# Altium project BUCK-BOOST_PWM_Controller.PrjPcb
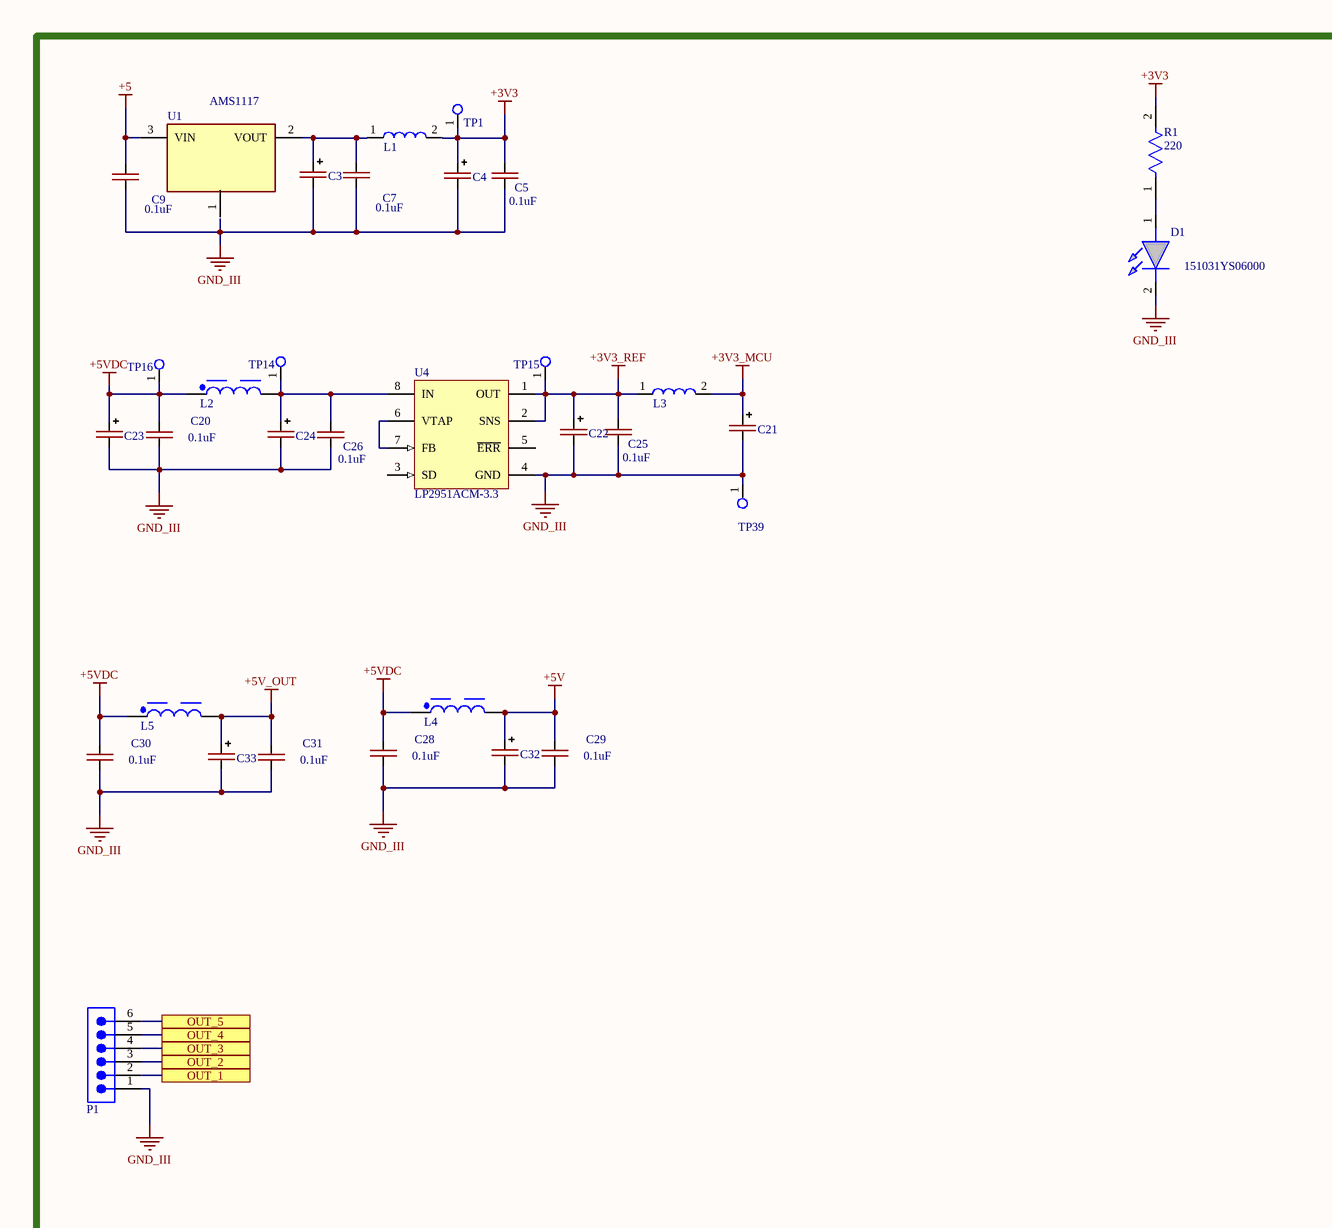
[diagram p0: BUCK-BOOST_PWM_Controller.SchDoc, top left]
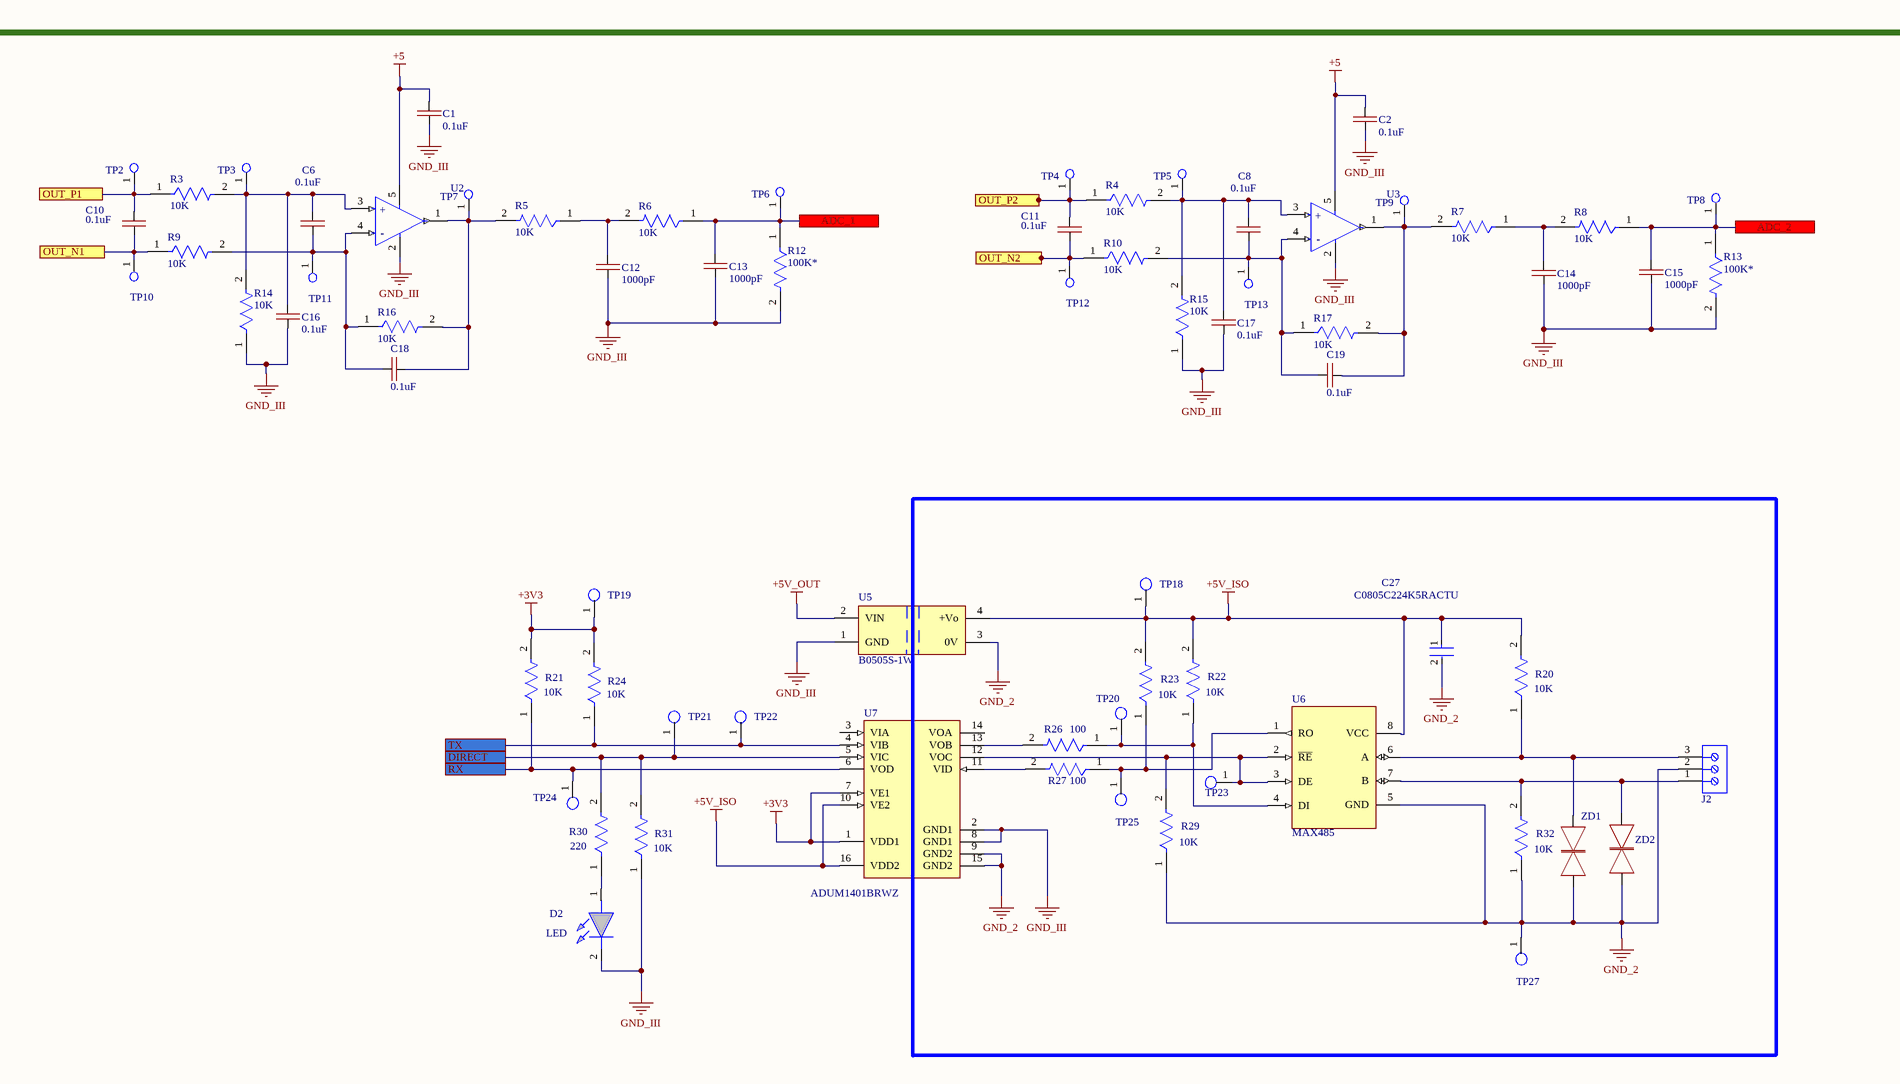
[diagram p1: BUCK-BOOST_PWM_Controller.SchDoc, top middle]
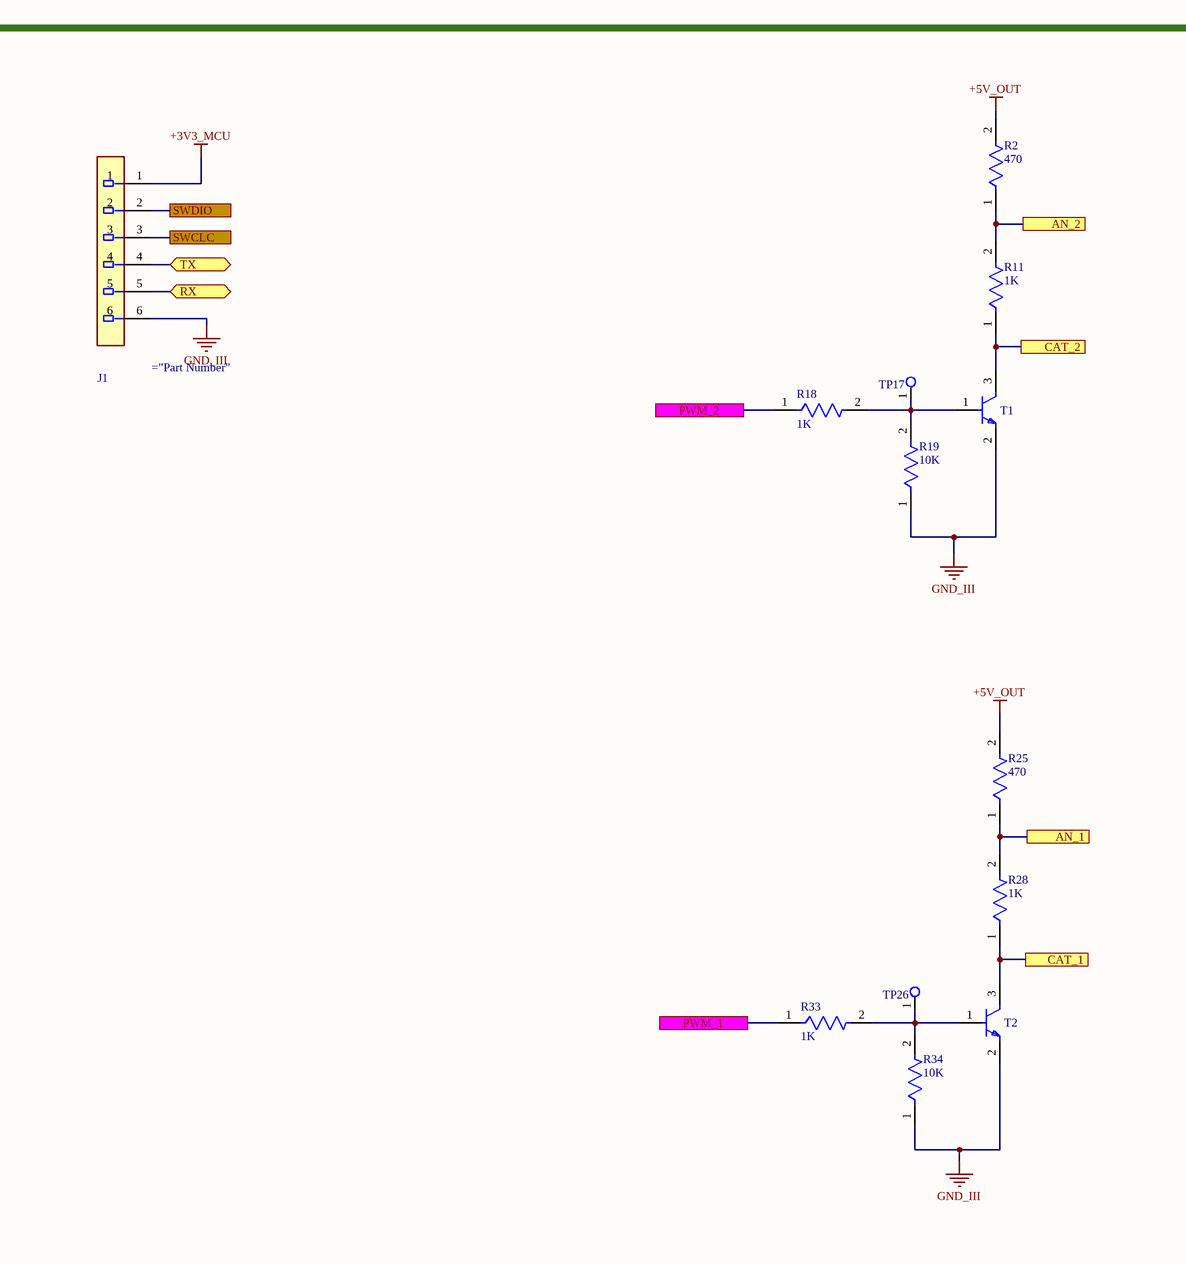
[diagram p2: BUCK-BOOST_PWM_Controller.SchDoc, top right]
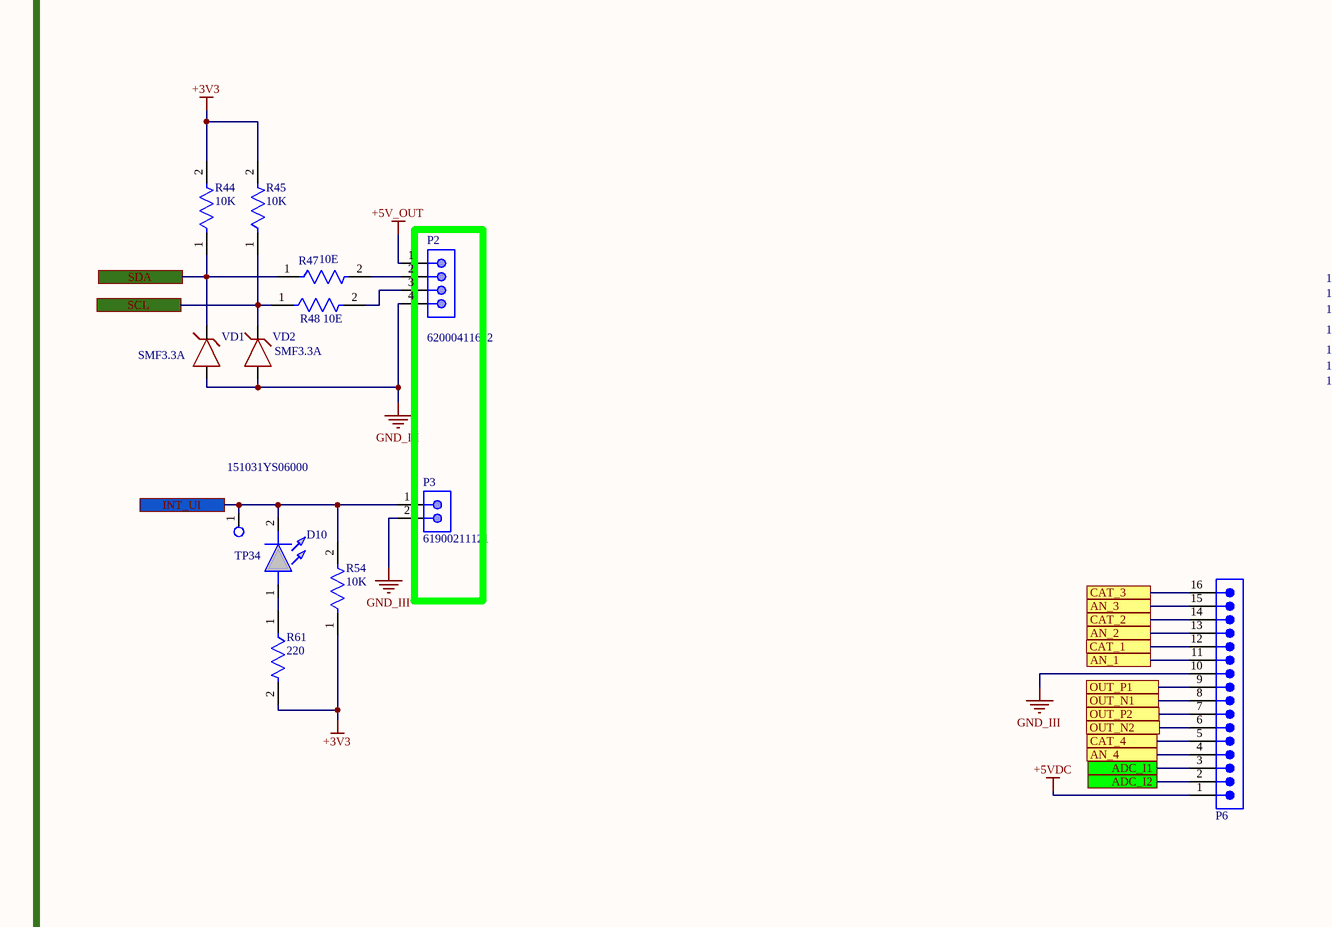
[diagram p3: BUCK-BOOST_PWM_Controller.SchDoc, bottom left]
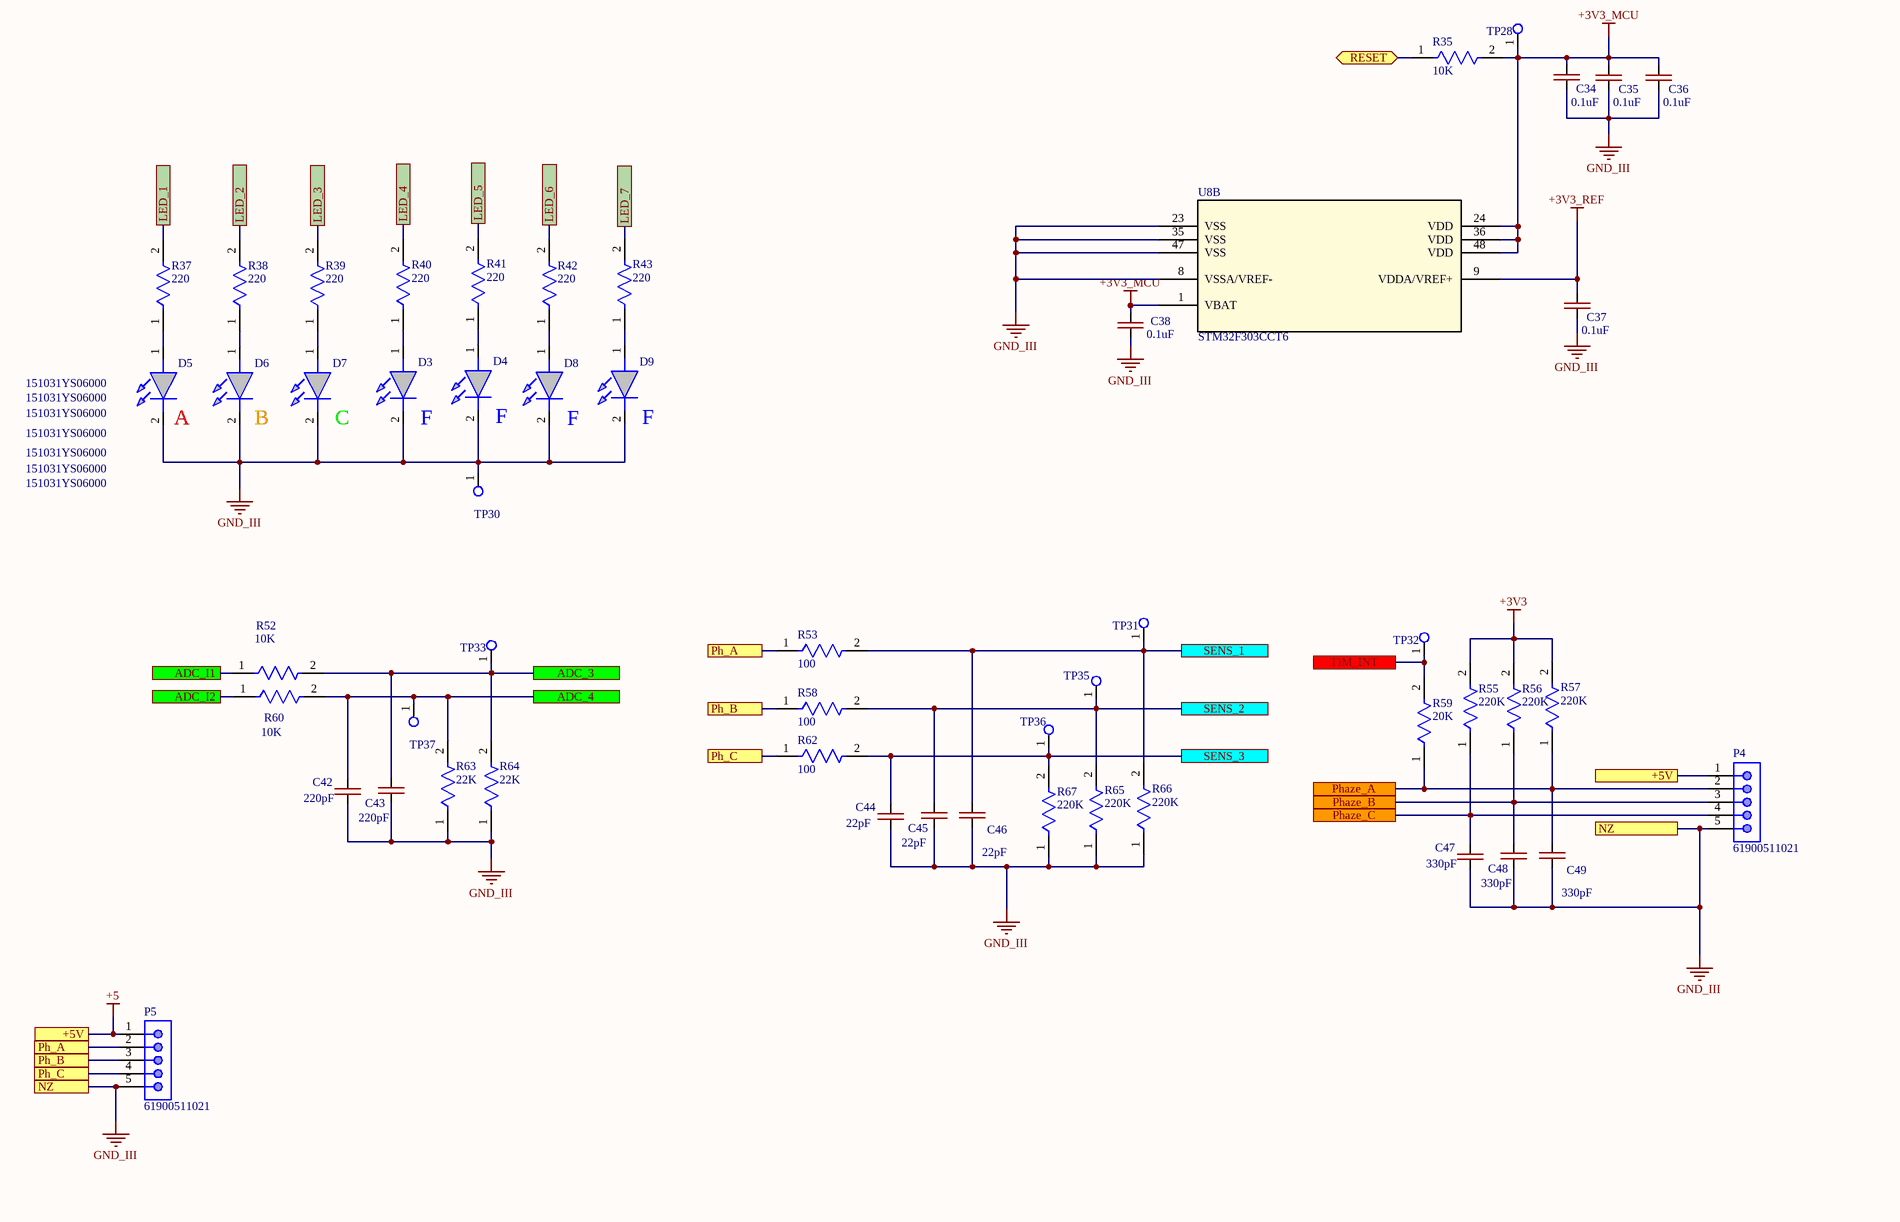
[diagram p4: BUCK-BOOST_PWM_Controller.SchDoc, bottom middle]
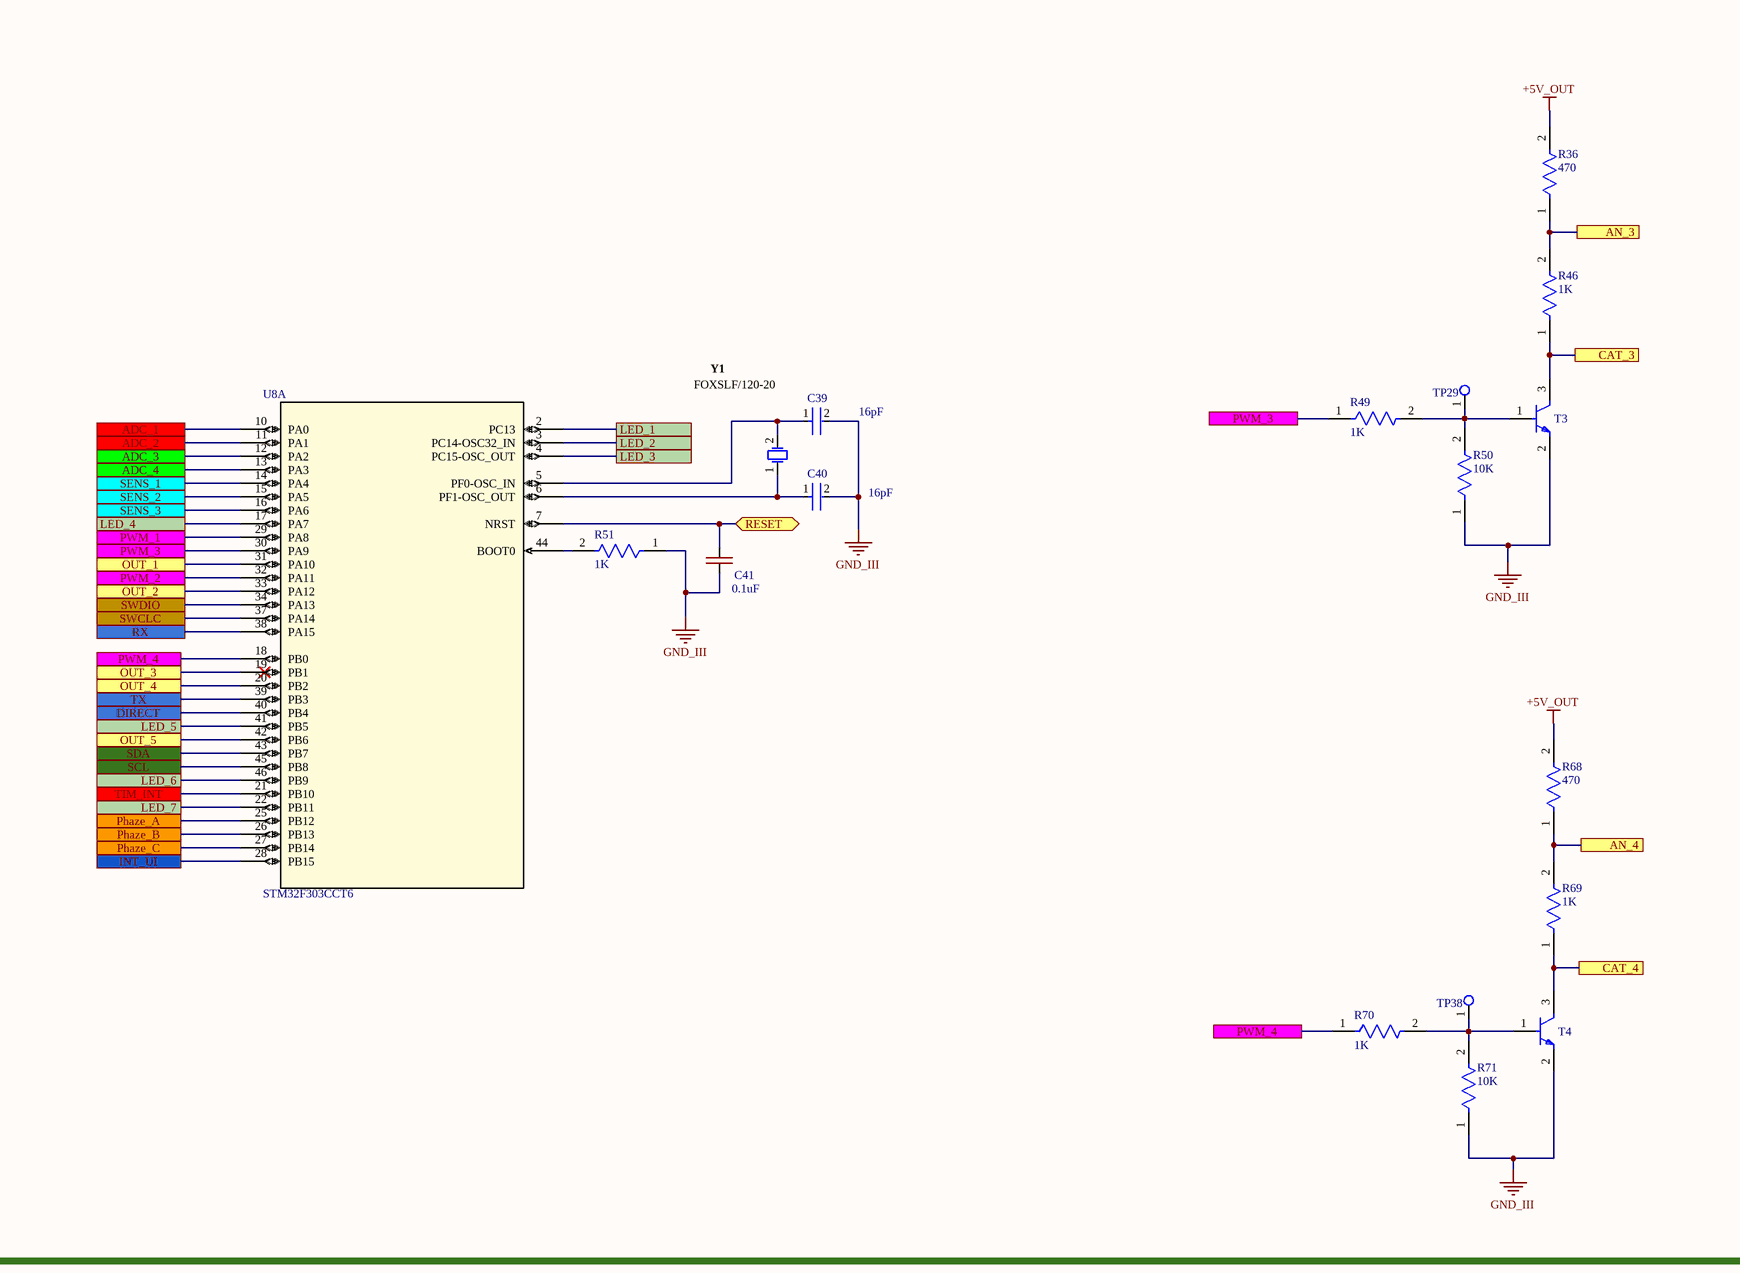
[diagram p5: BUCK-BOOST_PWM_Controller.SchDoc, bottom right]
1 sheet, 199 parts. Net scope: flat (ports and power ports of the same name join across sheets).
Board file: BUCK-BOOST_PWM_Controller.PcbDoc

## Sheet BUCK-BOOST_PWM_Controller.SchDoc
size A0; SheetNumber: 1; SheetTotal: 1; SPICEModelCacheFPQAHQWD: <root> / <DocumentId>FPQAHQWD</DocumentId> / <CacheFrame Number="0"> / <Model Name="7850_74477530_1m" Kind="CKT"> / <Text>******* / .subckt 7850_74477530_1m 1 2 / Rp 1 2 187304.915771 / Cp 1 2 4.36976277949p / Rs 1 N3 3.3 / L1 N3 2 1000u / .ends 7850_74477530_1m</Text> / </Model> / </CacheFrame> / </root>

### Parts
C1  0.1uF  [CAP-0805]
C2  0.1uF  [CAP-0805]
C3  CAP-POLAR  [CAP_SMD_Size_E]  (value not drawn)
C4  CAP-POLAR  [CAP_SMD_Size_E]  (value not drawn)
C5  0.1uF  [CAP-0805]
C6  0.1uF  [CAP-0805]
C7  0.1uF  [CAP-0805]
C8  0.1uF  [CAP-0805]
C9  0.1uF  [CAP-0805]
C10  0.1uF  [CAP-0805]
C11  0.1uF  [CAP-0805]
C12  1000pF  [CAP-0805]
C13  1000pF  [CAP-0805]
C14  1000pF  [CAP-0805]
C15  1000pF  [CAP-0805]
C16  0.1uF  [CAP-0805]
C17  0.1uF  [CAP-0805]
C18  0.1uF  [CAP-0805]
C19  0.1uF  [CAP-0805]
C20  0.1uF  [CAP-0805]
C21  CAP-POLAR  [CAP_SMD_Size_E]  (value not drawn)
C22  CAP-POLAR  [CAP-TAN-D]  (value not drawn)
C23  CAP-POLAR  [CAP_SMD_Size_E]  (value not drawn)
C24  CAP-POLAR  [CAP_SMD_Size_E]  (value not drawn)
C25  0.1uF  [CAP-0805]
C26  0.1uF  [CAP-0805]
C27  C0805C224K5RACTU  [FP-C0805C-DN-MFG]
C28  0.1uF  [CAP-0805]
C29  0.1uF  [CAP-0805]
C30  0.1uF  [CAP-0805]
C31  0.1uF  [CAP-0805]
C32  CAP-POLAR  [CAP_SMD_Size_E]  (value not drawn)
C33  CAP-POLAR  [CAP_SMD_Size_E]  (value not drawn)
C34  0.1uF  [CAP-0805]
C35  0.1uF  [CAP-0805]
C36  0.1uF  [CAP-0805]
C37  0.1uF  [CAP-0805]
C38  0.1uF  [CAP-0805]
C39  16pF  [FP-GRM21B-0_1-IPC_C]
C40  16pF  [FP-GRM21B-0_1-IPC_C]
C41  0.1uF  [CAP-0805]
C42  220pF  [CAP-0805]
C43  220pF  [CAP-0805]
C44  22pF  [CAP-0805]
C45  22pF  [CAP-0805]
C46  22pF  [CAP-0805]
C47  330pF  [CAP-0805]
C48  330pF  [CAP-0805]
C49  330pF  [CAP-0805]
D1  151031YS06000  [LED_GREEN]
D2  LED  [LED_BLUE]
D3  151031YS06000  [LED_BLUE]
D4  151031YS06000  [LED_BLUE]
D5  151031YS06000  [LED_RED]
D6  151031YS06000  [LED_YELLOW]
D7  151031YS06000  [LED_GREEN]
D8  151031YS06000  [LED_BLUE]
D9  151031YS06000  [LED_BLUE]
D10  151031YS06000  [LED_RED]
J1  SWR25X-NRTC-S06-ST-BA  [Sullins_SWR25X-NRTC-S06-ST-BA_MFG]  (value not drawn)
J2  (no value)  [691101710003]
L1  Coil  [NR4030]  (value not drawn)
L2  1000µH, 0.3A  [WE-PD2_7850]  (value not drawn)
L3  Coil  [NR4030]  (value not drawn)
L4  1000µH, 0.3A  [WE-PD2_7850]  (value not drawn)
L5  1000µH, 0.3A  [WE-PD2_7850]  (value not drawn)
P1  61300611121  [61300611121]  (value not drawn)
P2  62000411622  [62000411622]
P3  61900211121  [61900211121]
P4  61900511021  [61900511021]
P5  61900511021  [61900511021]
P6  61301611021  [61301611021]  (value not drawn)
R1  220  [RES-0805]
R2  470  [RES-0805]
R3  10K  [RES-0805]
R4  10K  [RES-0805]
R5  10K  [RES-0805]
R6  10K  [RES-0805]
R7  10K  [RES-0805]
R8  10K  [RES-0805]
R9  10K  [RES-0805]
R10  10K  [RES-0805]
R11  1K  [RES-0805]
R12  100K*  [RES-0805]
R13  100K*  [RES-0805]
R14  10K  [RES-0805]
R15  10K  [RES-0805]
R16  10K  [RES-0805]
R17  10K  [RES-0805]
R18  1K  [RES-0805]
R19  10K  [RES-0805]
R20  10K  [RES-0805]
R21  10K  [RES-0805]
R22  10K  [RES-0805]
R23  10K  [RES-0805]
R24  10K  [RES-0805]
R25  470  [RES-0805]
R26  100  [RES-0805]
R27  100  [RES-0805]
R28  1K  [RES-0805]
R29  10K  [RES-0805]
R30  220  [RES-0805]
R31  10K  [RES-0805]
R32  10K  [RES-0805]
R33  1K  [RES-0805]
R34  10K  [RES-0805]
R35  10K  [RES-0805]
R36  470  [RES-0805]
R37  220  [RES-0805]
R38  220  [RES-0805]
R39  220  [RES-0805]
R40  220  [RES-0805]
R41  220  [RES-0805]
R42  220  [RES-0805]
R43  220  [RES-0805]
R44  10K  [RES-0805]
R45  10K  [RES-0805]
R46  1K  [RES-0805]
R47  10E  [RES-0805]
R48  10E  [RES-0805]
R49  1K  [RES-0805]
R50  10K  [RES-0805]
R51  1K  [RES-0805]
R52  10K  [RES-0805]
R53  100  [RES-0805]
R54  10K  [RES-0805]
R55  220K  [RES-0805]
R56  220K  [RES-0805]
R57  220K  [RES-0805]
R58  100  [RES-0805]
R59  20K  [RES-0805]
R60  10K  [RES-0805]
R61  220  [RES-0805]
R62  100  [RES-0805]
R63  22K  [RES-0805]
R64  22K  [RES-0805]
R65  220K  [RES-0805]
R66  220K  [RES-0805]
R67  220K  [RES-0805]
R68  470  [RES-0805]
R69  1K  [RES-0805]
R70  1K  [RES-0805]
R71  10K  [RES-0805]
T1  BC847C  [SOT23-3_IPC_A]  (value not drawn)
T2  BC847C  [SOT23-3_IPC_A]  (value not drawn)
T3  BC847C  [SOT23-3_IPC_A]  (value not drawn)
T4  BC847C  [SOT23-3_IPC_A]  (value not drawn)
TP1  Test_Point_PCB  [Test_Point]  (value not drawn)
TP2  Test_Point_PCB  [Test_Point]  (value not drawn)
TP3  Test_Point_PCB  [Test_Point]  (value not drawn)
TP4  Test_Point_PCB  [Test_Point]  (value not drawn)
TP5  Test_Point_PCB  [Test_Point]  (value not drawn)
TP6  Test_Point_PCB  [Test_Point]  (value not drawn)
TP7  Test_Point_PCB  [Test_Point]  (value not drawn)
TP8  Test_Point_PCB  [Test_Point]  (value not drawn)
TP9  Test_Point_PCB  [Test_Point]  (value not drawn)
TP10  Test_Point_PCB  [Test_Point]  (value not drawn)
TP11  Test_Point_PCB  [Test_Point]  (value not drawn)
TP12  Test_Point_PCB  [Test_Point]  (value not drawn)
TP13  Test_Point_PCB  [Test_Point]  (value not drawn)
TP14  Test_Point_PCB  [Test_Point]  (value not drawn)
TP15  Test_Point_PCB  [Test_Point]  (value not drawn)
TP16  Test_Point_PCB  [Test_Point]  (value not drawn)
TP17  Test_Point_PCB  [Test_Point]  (value not drawn)
TP18  Test_Point_PCB  [Test_Point]  (value not drawn)
TP19  (no value)  [Test_Point]
TP20  Test_Point_PCB  [Test_Point]  (value not drawn)
TP21  Test_Point_PCB  [Test_Point]  (value not drawn)
TP22  Test_Point_PCB  [Test_Point]  (value not drawn)
TP23  Test_Point_PCB  [Test_Point]  (value not drawn)
TP24  Test_Point_PCB  [Test_Point]  (value not drawn)
TP25  (no value)  [Test_Point]
TP26  Test_Point_PCB  [Test_Point]  (value not drawn)
TP27  Test_Point_PCB  [Test_Point]  (value not drawn)
TP28  Test_Point_PCB  [Test_Point]  (value not drawn)
TP29  Test_Point_PCB  [Test_Point]  (value not drawn)
TP30  Test_Point_PCB  [Pin_Test_Point(Pink)]  (value not drawn)
TP31  Test_Point_PCB  [Test_Point]  (value not drawn)
TP32  Test_Point_PCB  [Test_Point]  (value not drawn)
TP33  Test_Point_PCB  [Test_Point]  (value not drawn)
TP34  Test_Point_PCB  [Test_Point]  (value not drawn)
TP35  Test_Point_PCB  [Test_Point]  (value not drawn)
TP36  Test_Point_PCB  [Test_Point]  (value not drawn)
TP37  Test_Point_PCB  [Test_Point]  (value not drawn)
TP38  Test_Point_PCB  [Test_Point]  (value not drawn)
TP39  Test_Point_PCB  [Pin_Test_Point(Orange)]  (value not drawn)
U1  AMS1117  [SOT-89]
U2  (no value)  [SOT-23-5]
U3  (no value)  [SOT-23-5]
U4  LP2951ACM-3.3  [D0008A_N]
U5  B0505S-1W  [B0505S-1W]
U6  MAX485  [SOIC-8-MFG]
U7  ADUM1401BRWZ  [ADI-RW-16_M]
U8  STM32F303CCT6  [LQFP48-7x7mm]  (parts A,B of 2)
VD1  SMF3.3A  [SMF3.3A]
VD2  SMF3.3A  [SMF3.3A]
Y1  FOXSLF/120-20  [FOX-FOXSLF-2_V]
ZD1  P6SMB16CA  [DO-214AA]  (value not drawn)
ZD2  P6SMB16CA  [DO-214AA]  (value not drawn)

### Ports
+5V, ADC_1, ADC_2, ADC_3, ADC_4, ADC_I1, ADC_I2, AN_1, AN_2, AN_3, AN_4, CAT_1, CAT_2, CAT_3, CAT_4, DIRECT, INT_UI, LED_1, LED_2, LED_3, LED_4, LED_5, LED_6, LED_7, NZ, OUT_1, OUT_2, OUT_3, OUT_4, OUT_5, OUT_N1, OUT_N2, OUT_P1, OUT_P2, Ph_A, Ph_B, Ph_C, Phaze_A, Phaze_B, Phaze_C, PWM_1, PWM_2, PWM_3, PWM_4, RESET (bidir), RX, RX (bidir), SCL, SDA, SENS_1, SENS_2, SENS_3, SWCLC, SWDIO, TIM_INT, TX, TX (bidir)

### Nets
+3V3: C4.1(+) C5.2 L1.2 R1.2 R21.2 R24.2 R44.2 R45.2 R54.1 R55.2 R56.2 R57.2 R61.2 TP1.1(G9) TP19.1(G9) U7.1(VDD1) U7.7(VE1)
+3V3_MCU: C21.1(+) C34.2 C35.2 C36.2 C38.2 J1.1 L3.2 R35.2 TP28.1(G9) U8.1(VBAT) U8.24(VDD) U8.36(VDD) U8.48(VDD)
+3V3_REF: C22.1(+) C25.2 C37.2 L3.1 TP15.1(G9) U4.1(OUT) U4.2(SNS) U8.9(VDDA/VREF+)
+5: C1.2 C2.2 C9.2 P4.1 P5.1 U1.3(VIN) U2.5(VDD) U3.5(VDD) ; port +5V
+5V: C29.2 C32.1(+) L4.2
+5V_ISO: C27.1 R20.2 R22.2 R23.2 TP18.1(G9) U5.4(+Vo) U6.8(VCC) U7.10(VE2) U7.16(VDD2)
+5V_OUT: C31.2 C33.1(+) L5.2 P2.1 R2.2 R25.2 R36.2 R68.2 U5.2(VIN)
+5VDC: C20.2 C23.1(+) C28.2 C30.2 L2.1 L4.1 L5.1 P6.1 TP16.1(G9)
GND_2: C27.2 J2.2 R29.1 R32.1 TP27.1(G9) U5.3(0V) U6.5(GND) U7.9(GND2) U7.15(GND2) ZD1.1(A) ZD2.1(A)
GND_III: C1.1 C2.1 C3.2(-) C4.2(-) C5.1 C7.1 C9.1 C12.1 C13.1 C14.1 C15.1 C16.1 C17.1 C20.1 C21.2(-) C22.2(-) C23.2(-) C24.2(-) C25.1 C26.1 C28.1 C29.1 C30.1 C31.1 C32.2(-) C33.2(-) C34.1 C35.1 C36.1 C37.1 C38.1 C39.2 C40.2 C41.1 C42.1 C43.1 C44.1 C45.1 C46.1 C47.1 C48.1 C49.1 D1.2(K) D2.2(K) D3.2(K) D4.2(K) D5.2(K) D6.2(K) D7.2(K) D8.2(K) D9.2(K) J1.6 P1.1 P2.4 P3.2 P4.5 P5.5 P6.10 R12.2 R13.2 R14.1 R15.1 R19.1 R31.1 R34.1 R50.1 R51.1 R63.1 R64.1 R65.1 R66.1 R67.1 R71.1 T1.2(E) T2.2(E) T3.2(E) T4.2(E) TP30.1(G9) TP39.1(G9) U2.2(VSS) U3.2(VSS) U4.4(GND) U5.1(GND) U7.2(GND1) U7.8(GND1) U8.8(VSSA/VREF-) U8.23(VSS) U8.35(VSS) U8.47(VSS) VD1.1(A) VD2.1(A) ; port NZ
NetC3_1: C3.1(+) C7.2 L1.1 U1.2(VOUT)
NetC6_1: C6.1 C18.1 R9.2 R16.1 TP11.1(G9) U2.4(VIN-)
NetC6_2: C6.2 C16.2 R3.2 R14.2 TP3.1(G9) U2.3(VIN+)
NetC8_1: C8.1 C19.1 R10.2 R17.1 TP13.1(G9) U3.4(VIN-)
NetC8_2: C8.2 C17.2 R4.2 R15.2 TP5.1(G9) U3.3(VIN+)
NetC10_1: C10.1 P6.8 R9.1 TP10.1(G9) ; port OUT_N1
NetC10_2: C10.2 P6.9 R3.1 TP2.1(G9) ; port OUT_P1
NetC11_1: C11.1 P6.6 R10.1 TP12.1(G9) ; port OUT_N2
NetC11_2: C11.2 P6.7 R4.1 TP4.1(G9) ; port OUT_P2
NetC12_2: C12.2 R5.1 R6.2
NetC13_2: C13.2 R6.1 R12.1 TP6.1(G9) U8.10(PA0) ; port ADC_1
NetC14_2: C14.2 R7.1 R8.2
NetC15_2: C15.2 R8.1 R13.1 TP8.1(G9) U8.11(PA1) ; port ADC_2
NetC18_2: C18.2 R5.2 R16.2 TP7.1(G9) U2.1(VOUT)
NetC19_2: C19.2 R7.2 R17.2 TP9.1(G9) U3.1(VOUT)
NetC24_1: C24.1(+) C26.2 L2.2 TP14.1(G9) U4.8(IN)
NetC39_1: C39.1 U8.5(PF0-OSC_IN) Y1.2
NetC40_1: C40.1 U8.6(PF1-OSC_OUT) Y1.1
NetC41_2: C41.2 R35.1 U8.7(NRST) ; port RESET
NetC42_2: C42.2 R60.2 R63.2 TP37.1(G9) U8.13(PA3) ; port ADC_4
NetC43_2: C43.2 R52.2 R64.2 TP33.1(G9) U8.12(PA2) ; port ADC_3
NetC44_2: C44.2 R62.2 R67.2 TP36.1(G9) U8.16(PA6) ; port SENS_3
NetC45_2: C45.2 R58.2 R65.2 TP35.1(G9) U8.15(PA5) ; port SENS_2
NetC46_2: C46.2 R53.2 R66.2 TP31.1(G9) U8.14(PA4) ; port SENS_1
NetC47_2: C47.2 P4.4 R55.1 U8.27(PB14) ; port Phaze_C
NetC48_2: C48.2 P4.3 R56.1 U8.26(PB13) ; port Phaze_B
NetC49_2: C49.2 P4.2 R57.1 R59.1 U8.25(PB12) ; port Phaze_A
NetD1_1: D1.1(A) R1.1
NetD2_1: D2.1(A) R30.1
NetD3_1: D3.1(A) R40.1
NetD4_1: D4.1(A) R41.1
NetD5_1: D5.1(A) R37.1
NetD6_1: D6.1(A) R38.1
NetD7_1: D7.1(A) R39.1
NetD8_1: D8.1(A) R42.1
NetD9_1: D9.1(A) R43.1
NetD10_1: D10.1(A) R61.1
NetD10_2: D10.2(K) P3.1 R54.2 TP34.1(G9) U8.28(PB15) ; port INT_UI
NetJ1_2: J1.2 U8.34(PA13) ; port SWDIO
NetJ1_3: J1.3 U8.37(PA14) ; port SWCLC
NetJ1_4: J1.4 R24.1 TP22.1(G9) U7.4(VIB) U8.39(PB3) ; port TX
NetJ1_5: J1.5 R21.1 TP24.1(G9) U7.6(VOD) U8.38(PA15) ; port RX
NetJ2_1: J2.1 R32.2 U6.7(B) ZD2.2(A)
NetJ2_3: J2.3 R20.1 U6.6(A) ZD1.2(A)
NetP1_2: P1.2 U8.31(PA10) ; port OUT_1
NetP1_3: P1.3 U8.33(PA12) ; port OUT_2
NetP1_4: P1.4 U8.19(PB1) ; port OUT_3
NetP1_5: P1.5 U8.20(PB2) ; port OUT_4
NetP1_6: P1.6 U8.42(PB6) ; port OUT_5
NetP2_2: P2.2 R47.2
NetP2_3: P2.3 R48.2
NetP5_2: P5.2 R53.1 ; port Ph_A
NetP5_3: P5.3 R58.1 ; port Ph_B
NetP5_4: P5.4 R62.1 ; port Ph_C
NetP6_2: P6.2 R60.1 ; port ADC_I2
NetP6_3: P6.3 R52.1 ; port ADC_I1
NetP6_4: P6.4 R68.1 R69.2 ; port AN_4
NetP6_5: P6.5 R69.1 T4.3(C) ; port CAT_4
NetP6_11: P6.11 R25.1 R28.2 ; port AN_1
NetP6_12: P6.12 R28.1 T2.3(C) ; port CAT_1
NetP6_13: P6.13 R2.1 R11.2 ; port AN_2
NetP6_14: P6.14 R11.1 T1.3(C) ; port CAT_2
NetP6_15: P6.15 R36.1 R46.2 ; port AN_3
NetP6_16: P6.16 R46.1 T3.3(C) ; port CAT_3
NetR18_1: R18.1 U8.32(PA11) ; port PWM_2
NetR18_2: R18.2 R19.2 T1.1(B) TP17.1(G9)
NetR22_1: R22.1 R26.1 TP20.1(G9) U6.4(DI)
NetR23_1: R23.1 R27.1 TP25.1(G9) U6.1(RO)
NetR26_2: R26.2 U7.13(VOB)
NetR27_2: R27.2 U7.11(VID)
NetR29_2: R29.2 TP23.1(G9) U6.2(~{RE}) U6.3(DE) U7.12(VOC)
NetR30_2: R30.2 R31.2 TP21.1(G9) U7.5(VIC) U8.40(PB4) ; port DIRECT
NetR33_1: R33.1 U8.29(PA8) ; port PWM_1
NetR33_2: R33.2 R34.2 T2.1(B) TP26.1(G9)
NetR37_2: R37.2 U8.2(PC13) ; port LED_1
NetR38_2: R38.2 U8.3(PC14-OSC32_IN) ; port LED_2
NetR39_2: R39.2 U8.4(PC15-OSC_OUT) ; port LED_3
NetR40_2: R40.2 U8.17(PA7) ; port LED_4
NetR41_2: R41.2 U8.41(PB5) ; port LED_5
NetR42_2: R42.2 U8.46(PB9) ; port LED_6
NetR43_2: R43.2 U8.22(PB11) ; port LED_7
NetR44_1: R44.1 R47.1 U8.43(PB7) VD1.2(C) ; port SDA
NetR45_1: R45.1 R48.1 U8.45(PB8) VD2.2(C) ; port SCL
NetR49_1: R49.1 U8.30(PA9) ; port PWM_3
NetR49_2: R49.2 R50.2 T3.1(B) TP29.1(G9)
NetR51_2: R51.2 U8.44(BOOT0)
NetR59_2: R59.2 TP32.1(G9) U8.21(PB10) ; port TIM_INT
NetR70_1: R70.1 U8.18(PB0) ; port PWM_4
NetR70_2: R70.2 R71.2 T4.1(B) TP38.1(G9)
NetU4_6: U4.6(VTAP) U4.7(FB)

Not connected (* = marked no-connect by the designer): U1 1(Ground); U4 3(SD) 5(~{ERR}); U7 3(VIA) 14(VOA)

### Notes on the sheet
- (near D5) A
- (near D6) B
- (near D7) C
- (near D3) F
- (near D4) F
- (near D8) F
- (near D9) F
- (in symbol MCP6001T) +; -

### Library data of the parts
C1 C2 C5-C20 C25 C26 C28-C31 C34-C38 C41-C49 = CAP-NON-POLAR
C27 = CMP-1036-04552-2: CAP CER 0.22UF 50V X7R 0805; Manufacturer: KEMET; Value: 0.22 μF; Temperature Coefficient: 30ppm/°C; Material: Ceramic; Tolerance: 0.1; ComponentLink2URL: https://content.kemet.com/datasheets/KEM_C1003_C0G_SMD.pdf; Temperature Characteristic: X7R; Device Class L3: Ceramic Capacitors; Lead Free: Yes; Temperature: -55°C to +125°C; RoHS: TRUE; Capacitance: 0.22 μF; Automotive: No; Octopart: https://octopart.com/c0805c224k5ractu-kemet-144670; Manufacturer Part Number: C0805C224K5RACTU; Temperature Range Low: -55°C; Height: 0.88mm; Device Class L1: Passive Components; Digikey Description: CAP CER 0.22UF 50V X7R 0805; ComponentLink2Description: Datasheet; Mouser Description: CAP CER 0.22UF 50V X7R 0805; Category: Cap; Ipc Land Pattern Name: CAPC200125X78; Temperature Range High: +125°C; Package: C0805C-DN; Device Class L2: Capacitors; Voltage Rating: 50 V
C39 C40 = CMP-2007-03453-2: Chip Multilayer Ceramic Capacitors for General Purpose, 0805, 16pF, X5R, 15%, 10%, 16V; Capacitance: 10uF; Radiation Hardening: No; Thickness: 0.053inch; Voltage Rating (DC): 16V; Lead Free: Lead Free; Package Quantity: 1; Width: 1.25mm; Case Code (Imperial): 0805; Depth: 1.25mm; Packaging: Tape and Reel; Dielectric: X5R; Max Operating Temperature: 85°C; Tolerance: 10%; Voltage Rating: 16V; Voltage: 16V; Height: 1.25mm; Case Code (Metric): 2012; Material: Ceramic; Mount: Surface Mount; Case/Package: 0805; REACH SVHC: No SVHC; Length: 2mm; Min Operating Temperature: -55°C; Termination: SMD/SMT
D1-D10 = LED: WURTH ELEKTRONIK - 151031YS06000 - LED, Yellow, Through Hole, T-1 (3mm), 30 mA, 2 V, 590 nm; Geometry.Height: 5.5mm; Manufacturer_Name: Wurth Elektronik; Manufacturer_Part_Number: 151031YS06000; Mouser Part Number: 710-151031YS06000; Mouser Price/Stock: https://www.mouser.co.uk/ProductDetail/Wurth-Elektronik/151031YS06000?qs=LlUlMxKIyB3xSYYW%252BcuBiQ%3D%3D; Arrow Part Number: *; Arrow Price/Stock: *; Mouser Testing Part Number: *; Mouser Testing Price/Stock: *; Datasheet Link: https://katalog.we-online.de/led/datasheet/151031YS06000.pdf
J2 = 691101710003: WR-TBL Series 101 Horizontal Entry Modular, Through Hole, pitch 5mm, 3p; Manufacturer: Wurth Elektronik; Pin Number: 3; Rated Current: 16A; Working Voltage: 250V; PCB/Cable/Panel: PCB; Modularity: Yes; ComponentLink1Description: Manufacturer Link; ComponentLink1URL: https://www.we-online.com/redexpert/article/691101710003?ad; ComponentLink2Description: Datasheet; ComponentLink2URL: https://www.we-online.com/redexpert/spec/691101710003?ad; Category: Terminal Blocks; Match Code: WR-TBL; Manufacturer Part Number: 691101710003; Mount: Through Hole; Operating Temperature Max: 105°C; Operating Temperature Min: -40°C; Packaging: Box; Pitch: 5mm; Orientation: Horizontal; Application: Pressure Clamp
L2 L4 L5 = 74477530: WE-PD2 SMT Power Inductor, size 7850, 1000µH, 0.3A, 3.3Ω; Manufacturer: Wurth Elektronik; Case/Size Code: 7850; DC Resistance: 2.78Ω; Self Resonant Frequency: 2.4MHz; Manufacturer Part Number: 74477530; Category: Unshielded Power Inductors; Match Code: WE-PD2; ComponentLink1Description: Website Link; ComponentLink1URL: https://www.we-online.com/redexpert/article/74477530?ad; ComponentLink2Description: Datasheet Link; ComponentLink2URL: https://www.we-online.com/redexpert/spec/74477530?ad; Mount: Surface Mount; Operating Temperature Max: 125°C; Operating Temperature Min: -40°C; Packaging: Tape and Reel; Length: 7.8mm; Width: 7mm; Height: 4.95mm; DC Resistance Max: 3.3Ω; Inductance: 1000µH; Rated Current: 0.3A; Saturation Current: 0.3A
P1 = 61300611121: WR-PHD Pin Header, THT, Vertical, pitch 2.54mm, 1 Row, 6P; Manufacturer: Wurth Elektronik; Contact Resistance: 20mΩ; Rated Current: 3A; Working Voltage: 250V; Withstanding Voltage: 500V; ComponentLink1Description: Website Link; ComponentLink1URL: https://www.we-online.com/redexpert/article/61300611121?ad; ComponentLink2Description: Datasheet Link; ComponentLink2URL: https://www.we-online.com/redexpert/spec/61300611121?ad; Manufacturer Part Number: 61300611121; Category: Board-to-Board Connectors; Match Code: WR-PHD; Mount: Through Hole; Operating Temperature Max: 105°C; Operating Temperature Min: -40°C; Packaging: Bag; Gender: Pin Header; Number of Pins: 6; Number of Rows: 1; Orientation: Vertical; Pitch: 2.54mm
P2 = 62000411622: WR-WTB Male Vertical Shrouded Header, pitch 2mm, 4p; Pin Number: 4; Contact Resistance: 20mOhm; Rated Current: 2A; Withstanding Voltage: 800VAC; Working Voltage: 125VAC; ComponentLink1Description: Manufacturer; ComponentLink1URL: http://www.we-online.de; ComponentLink2Description: Datasheet; ComponentLink2URL: https://www.we-online.com/catalog/datasheet/62000411622.pdf; Pitch: 2mm; Published Date: January 2020; Publisher: Wurth Elektronik; Mounting Technology: THT; Packaging: Bag; Operating Temperature: -25 to +85degC; Part Number: 62000411622; Gender: Male; Type: Vertical
P3 = 61900211121: WR-WTB THT Male Vertical Locking Header, pitch 2.54mm, 2p; Pin Number: 2; Contact Resistance: 20mOhm; Rated Current: 3A; Withstanding Voltage: 1000VAC; Working Voltage: 250VAC; ComponentLink1Description: Manufacturer; ComponentLink1URL: http://www.we-online.de; ComponentLink2Description: Datasheet; ComponentLink2URL: https://www.we-online.com/catalog/datasheet/61900211121.pdf; Pitch: 2.54mm; Published Date: January 2020; Publisher: Wurth Elektronik; Mounting Technology: THT; Packaging: Bag; Operating Temperature: -40 to +105degC; Part Number: 61900211121; Gender: Male; Type: Vertical
P4 P5 = 61900511021: WR-WTB THT Male Left Angled Bottom Locking Header, pitch 2.54mm, 5p; Pin Number: 5; Contact Resistance: 20mOhm; Rated Current: 3A; Withstanding Voltage: 1000VAC; Working Voltage: 250VAC; ComponentLink1Description: Manufacturer; ComponentLink1URL: http://www.we-online.de; ComponentLink2Description: Datasheet; ComponentLink2URL: https://www.we-online.com/catalog/datasheet/61900511021.pdf; Pitch: 2.54mm; Published Date: January 2020; Publisher: Wurth Elektronik; Mounting Technology: THT; Packaging: Bag; Operating Temperature: -40 to +105degC; Part Number: 61900511021; Gender: Male; Type: Right Angled Bottom Locking
P6 = 61301611021: WR-PHD Pin Header, THT, Angled, pitch 2.54mm, 1 Row, 16P; Manufacturer: Wurth Elektronik; Contact Resistance: 20mΩ; Rated Current: 3A; Working Voltage: 250V; Withstanding Voltage: 500V; ComponentLink1Description: Website Link; ComponentLink1URL: https://www.we-online.com/redexpert/article/61301611021?ad; ComponentLink2Description: Datasheet Link; ComponentLink2URL: https://www.we-online.com/redexpert/spec/61301611021?ad; Manufacturer Part Number: 61301611021; Category: Board-to-Board Connectors; Match Code: WR-PHD; Mount: Through Hole; Operating Temperature Max: 105°C; Operating Temperature Min: -40°C; Packaging: Bag; Gender: Pin Header; Number of Pins: 16; Number of Rows: 1; Orientation: Angled; Pitch: 2.54mm
R1-R71 = RES-CONST
TP1-TP39 = TP_PCB?: Test_Point
U2 U3 = MCP6001T: IC OPAMP GP 1 CIRCUIT SOT23-5; Number of Amplifiers: 1; Voltage: 6V; Power Supply Rejection Ratio (PSRR): 86dB; Common Mode Rejection Ratio: 60dB; Unity Gain Bandwidth Product: 1MHz; Slew Rate: 0.6V/µs; Output Current per Channel: 23mA; Nominal Supply Current: 100uA; Input Offset Voltage (Vos): 4.5mV; Input Bias Current: 1pA; Operating Supply Voltage: 5.5V; Min Supply Voltage: 1.8V; Voltage Gain: 112dB; Length: 3.1mm; REACH SVHC: No SVHC; Number of Pins: 5; Package Quantity: 1; Radiation Hardening: No; Mount: Surface Mount; Number of Circuits: 1; Number of Elements: 1; Output Current: 23mA; Packaging: Tape and Reel; Height: 1.3mm; Lead Free: Lead Free; Min Operating Temperature: -40°C; Bandwidth: 1MHz; Contact Plating: Tin; Max Supply Voltage: 6V; Max Operating Temperature: 85°C; Width: 1.8mm; Case/Package: SOT-23; Operating Supply Current: 100uA; Number of Channels: 1; Gain Bandwidth Product: 1MHz
U4 = CMP-0062-01032-3: Series of Adjustable Micropower Voltage Regulators, 8-pin Narrow SOIC; Manufacturer: Texas Instruments; CompType: LDO IC; PowerWise: N; PackageTopMarking: NSZXTT*2951A*CM33DD; PinCount: 8; PackageReference: D0008A; ComponentLink1Description: Datasheet URL; Code_JEDEC: MS-012-AA; Code_IPC: SOIC127P600-8; RoHS: N; ComponentLink1URL: http://www.ti.com/general/docs/lit/getliterature.tsp?genericPartNumber=LP2951-N&fileType=pdf; PackageDescription: SOIC Narrow, 4.9 x 3.9 x 1.45mm, 8 Lead, 1.27mm Pitch
U7 = CMP-0534-00565-1: Quad Channel Digital Isolator, 2.5 KV rms Insulation Rating, 10 Mbps Data Rate, 50 ns Delay, Industrial, 16-pin SOIC (RW-16), Tube; Manufacturer: Analog Devices; Max Data Rate: 10Mbps; ComponentLink2URL: http://www.analog.com/static/imported-files/data_sheets/ADuM1400_1401_1402.pdf; ComponentLink5Description: URL Link2; ComponentLink3URL: http://www.analog.com/static/imported-files/packages/PKG_PDF/SOIC_WIDE%20%28RW%29/RW_16.pdf; DatasheetVersion: Rev. H; ComponentLink2Description: Datasheet; ComponentLink3Description: Package Specification; PartNumber: ADUM1401BRWZ; ComponentLink5URL: Reference Circuit:http://www.analog.com/en/interface-isolation/digital-isolators/adum1401/products/product.html#product-recommendations; Max Operating Temp (degreesC): 125; PackageReference: RW-16; PackageVersion: 032707-B, 03/2007; ComponentLink1Description: Manufacturer URL; Code_JEDEC: MS-013-AA; PackageDescription: 16-Pin Standard Small Outline Package, Body 10.3 x 7.5 mm, Pitch 1.27 mm; Mounting Technology: Surface Mount; ComponentLink1URL: http://www.analog.com/en/index.html; ComponentLink4Description: URL Link1; ComponentLink4URL: Product URL:http://www.analog.com/en/interface-isolation/digital-isolators/adum1401/products/product.html
U8 = STM32F303CCT6: No Description Available; Mfr_Name: STMicroelectronics; RefDes: RefDes; Type: Type
VD1 VD2 = ESD_Unidirect
Y1 = CMP-1749-00004-1: Resistance Weld Thru-Hole Crystal, 12 MHz, +/-30 ppm, -20 to 70 degC, 2-Pin THD, RoHS, Bulk; Elements: 1; Rds On Max: 115 mohm; Typical Rise Time: 90 ns; Max Power Dissipation: 2.5 W; Case\Package: TO-251-3; Input Capacitance: 350 pF; REACH SVHC: No SVHC; Length: 6.6 mm; ComponentLink1URL: http://www.foxonline.com/; PackageDescription: 2-Pin Through Hole Device, Body 11.35 x 4.65 mm, Pitch 4.88 mm; Radiation Hardening: No; Package Quantity: 70; Packaging: Rail/Tube; ComponentLink1Description: Manufacturer URL; Min Operating Temperature: -55 degC; Max Operating Temperature: 150 degC; RoHSCompliant: true; PackageReference: FOXSLF-2; DatasheetVersion: Mar-15; Pins: 3; Height: 6.1 mm; Mount: Through Hole; ComponentLink2URL: http://www.foxonline.com/pdfs/hc49slf.pdf; ComponentLink2Description: Datasheet; Width: 2.3 mm